# Altium schematic sheet MS5607.SchDoc
size A4; Organization: Altium Limited; Address1: L3, 12a Rodborough Rd; Address2: Frenchs Forest; Address3: NSW; Address4: Australia 2086; SheetNumber: 7; SheetTotal: 10
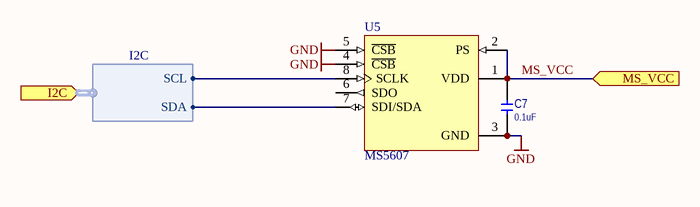
[diagram p0: MS5607.SchDoc]

## Parts
C7  value 0.1uF  [CERCAP 0402]
U5  MS5607  [QFN-8(MS5607)]

## Ports
I2C (in, harness I2C), MS_VCC (in)

## Harnesses
I2C: SDA, SCL

## Nets
GND: C7.1 U5.3(GND) U5.4(~{CSB}) U5.5(~{CSB})
MS_VCC: C7.2 U5.1(VDD) U5.2(PS) ; port MS_VCC
NetU5_7: U5.7(SDI/SDA) ; port I2C.SDA
NetU5_8: U5.8(SCLK) ; port I2C.SCL

Not connected (* = marked no-connect by the designer): U5 6(SDO)

## Notes on the sheet
- Title
- Size:
- Date:
- A4
- Number:
- Time:
- Revision:
- Sheet
- of
- File:

## Library data of the parts
C7 = !Capacitor: Capacitor; IsSMT: NoSMT; Diel: X7R; Voltage: *
U5 = MS5607: Temp/Pres; IsSMT: NoSMT